# Altium schematic sheet DAC.SchDoc
size Letter; PageSetup: Record=PageOptions|CenterHorizontal=True|CenterVertical=True|PrintScale=0.75|XCorrection=1.00|YCorrection=1.00|PrintKind=1|BorderSize=5000000|LeftOffset=0|BottomOffset=0|Orientation=2|PaperLength=1000|PaperWidth=1000|Scale=100|PaperSource=7|PrintQuality=-4|MediaType=1|DitherType=10|PaperKind=Letter|PrintScaleMode=1; Author: Adam Gilbert; CompanyName: McGill University; DrawnBy: Adam Gilbert; Organization: Altium Limited; Address1: McGill Cosmology; Address2: 3600 University Street; Address3: Montreal, Quebec; Address4: Canada; DocumentNumber: 7; Revision: Rev2; SheetNumber: 7; SheetTotal: 16; ProjectTitle: DfMux FMC Mezz; ModelNumber: MGMEZZ04; ProjectName: DfMux FMC Mezz
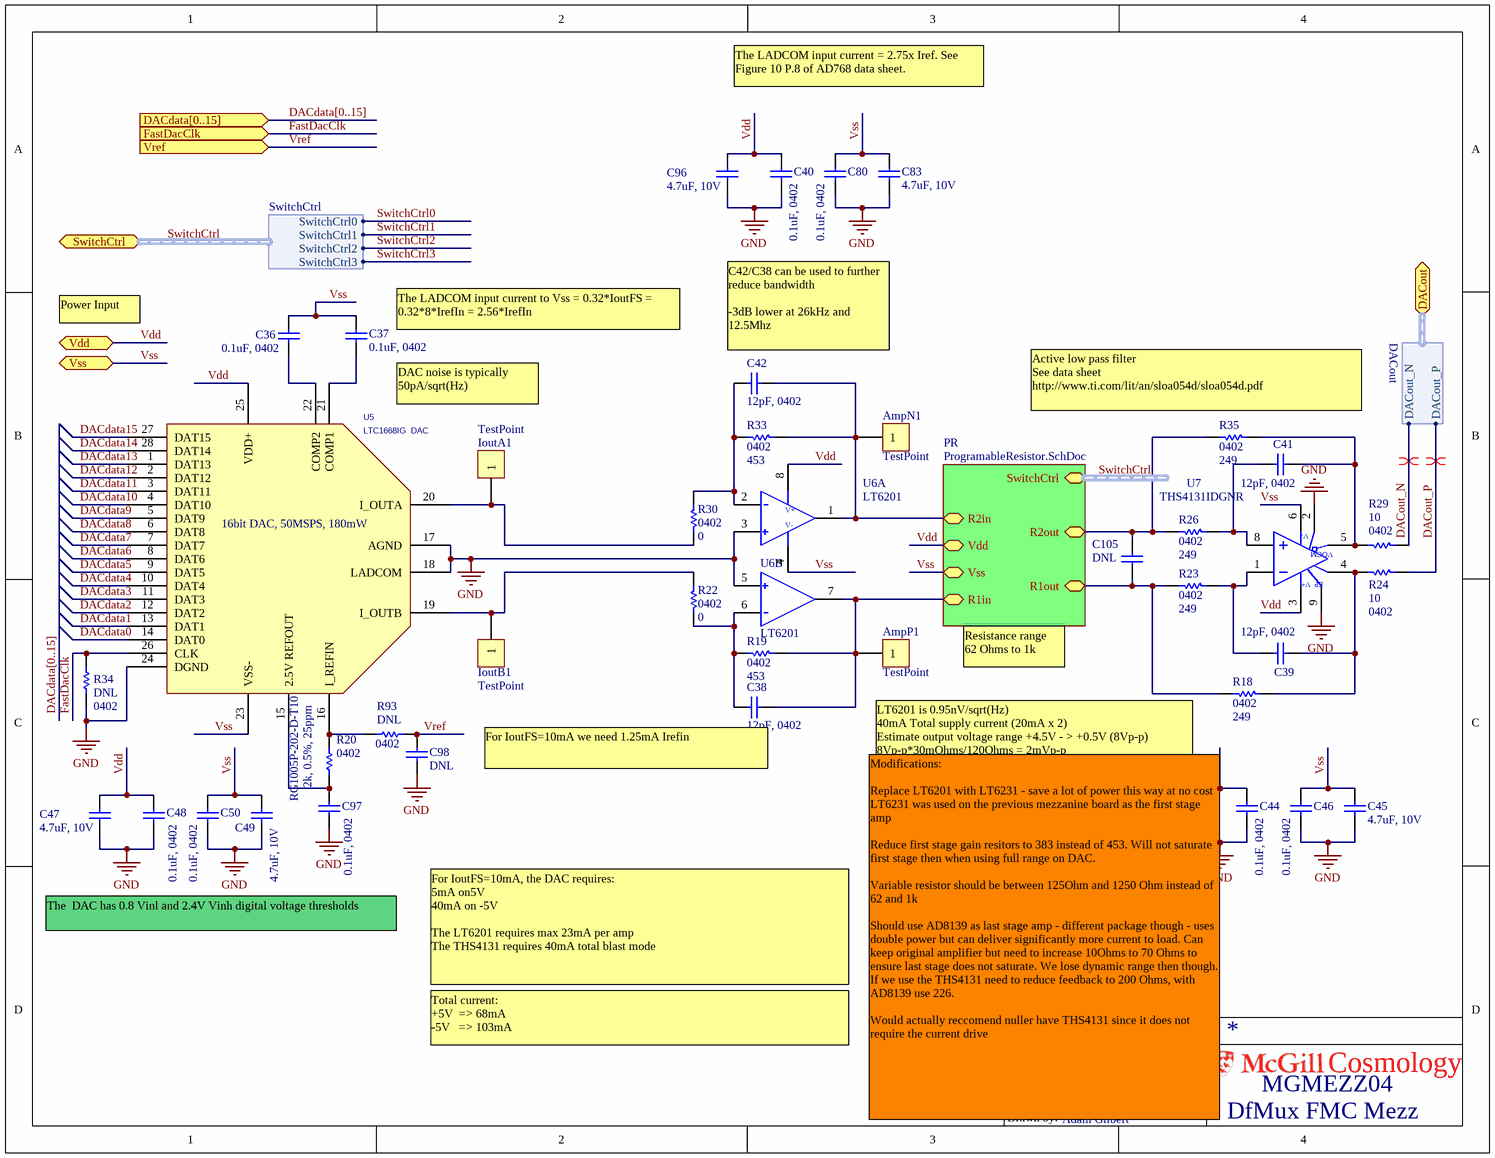
[diagram p0: DAC.SchDoc]

## Parts
AmpN1  TestPoint  [TP-3520-SK]  (no BOM)
AmpP1  TestPoint  [TP-3520-SK]  (no BOM)
C36  0.1uF, 0402  [0402]
C37  0.1uF, 0402  [0402]
C38  12pF, 0402  [0402]
C39  12pF, 0402  [0402]
C40  0.1uF, 0402  [0402]
C41  12pF, 0402  [0402]
C42  12pF, 0402  [0402]
C43  4.7uF, 10V  [0805]
C44  0.1uF, 0402  [0402]
C45  4.7uF, 10V  [0805]
C46  0.1uF, 0402  [0402]
C47  4.7uF, 10V  [0805]
C48  0.1uF, 0402  [0402]
C49  4.7uF, 10V  [0805]
C50  0.1uF, 0402  [0402]
C80  0.1uF, 0402  [0402]
C83  4.7uF, 10V  [0805]
C96  4.7uF, 10V  [0805]
C97  0.1uF, 0402  [0402]
C98  DNL  [0805]
C105  DNL  [0402]
IoutA1  TestPoint  [TP-3520-SK]  (no BOM)
IoutB1  TestPoint  [TP-3520-SK]  (no BOM)
R18  249  [0402]
R19  453  [0402]
R20  Manufacturer Part Number 1: RG1005P-202-D-T10  [0402]  (hidden comment: 2k, 0.5%, 25ppm)
R22  0  [0402]
R23  249  [0402]
R24  10  [0402]
R26  249  [0402]
R29  10  [0402]
R30  0  [0402]
R33  453  [0402]
R34  DNL  [0402]
R35  249  [0402]
R93  DNL  [0402]
U5  LTC1668IG  DAC  [SOG.65M/28/WG8.20/L10.16]
U6  LT6201  [SO8]  (parts A,B of 2)
U7  THS4131IDGNR  [SOP8-EP-127P600-8N]

## Sub-sheets
PR = ProgramableResistor.SchDoc: R1in, R2in, R1out, R2out, Vdd, Vss, SwitchCtrl (harness SwitchCtrl)

## Ports
DACdata[0..15] (in), DACout (harness DACout), FastDacClk (in), SwitchCtrl (harness SwitchCtrl), Vdd, Vref (in), Vss

## Harnesses
DACout: DACout_N, DACout_P
SwitchCtrl: SwitchCtrl0, SwitchCtrl1, SwitchCtrl2, SwitchCtrl3

## Nets
GND: C40.1 C43.1 C44.1 C45.1 C46.1 C47.1 C48.1 C49.1 C50.1 C80.1 C83.1 C96.1 C97.1 C98.1 R34.1 U5.17(AGND) U5.18(LADCOM) U5.24(DGND) U6.3(IN+) U6.5(IN+) U7.2(VOCM) U7.9(EP)
DACdata0: U5.14(DAT0)
DACdata1: U5.13(DAT1)
DACdata2: U5.12(DAT2)
DACdata3: U5.11(DAT3)
DACdata4: U5.10(DAT4)
DACdata5: U5.9(DAT5)
DACdata6: U5.8(DAT6)
DACdata7: U5.7(DAT7)
DACdata8: U5.6(DAT8)
DACdata9: U5.5(DAT9)
DACdata10: U5.4(DAT10)
DACdata11: U5.3(DAT11)
DACdata12: U5.2(DAT12)
DACdata13: U5.1(DAT13)
DACdata14: U5.28(DAT14)
DACdata15: U5.27(DAT15)
DACout_N: R29.2 ; port DACout.DACout_N
DACout_P: R24.2 ; port DACout.DACout_P
FastDacClk: R34.2 U5.26(CLK) ; port FastDacClk
SwitchCtrl0: port SwitchCtrl.SwitchCtrl0  [project net SwitchCtrl.SwitchCtrl0]
SwitchCtrl1: port SwitchCtrl.SwitchCtrl1  [project net SwitchCtrl.SwitchCtrl1]
SwitchCtrl2: port SwitchCtrl.SwitchCtrl2  [project net SwitchCtrl.SwitchCtrl2]
SwitchCtrl3: port SwitchCtrl.SwitchCtrl3  [project net SwitchCtrl.SwitchCtrl3]
Vdd: C40.2 C43.2 C44.2 C47.2 C48.2 C96.2 U5.25(VDD+) U6.8(V+) U7.3(V+) ; port Vdd, sheet PR/Vdd
Vref: C98.2 R93.1 ; port Vref
Vss: C36.2 C37.2 C45.2 C46.2 C49.2 C50.2 C80.2 C83.2 U5.23(VSS-) U6.4(V-) U7.6(V-) ; port Vss, sheet PR/Vss
NetAmpN1_1: AmpN1.1 C42.1 R33.2 U6.1(Out) ; sheet PR/R2in
NetAmpP1_1: AmpP1.1 C38.1 R19.2 U6.7(Out) ; sheet PR/R1in
NetC36_1: C36.1 U5.22(COMP2)
NetC37_1: C37.1 U5.21(COMP1)
NetC38_2: C38.2 R19.1 R22.1 U6.6(IN-)
NetC39_1: C39.1 R18.2 R24.1 U7.4(OUT+)
NetC39_2: C39.2 R23.2 U7.1(IN-)
NetC41_1: C41.1 R29.1 R35.2 U7.5(OUT-)
NetC41_2: C41.2 R26.2 U7.8(IN+)
NetC42_2: C42.2 R30.2 R33.1 U6.2(IN-)
NetC97_2: C97.2 R20.1 U5.15(2.5V_REFOUT)
NetC105_1: C105.1 R26.1 R35.1 ; sheet PR/R2out
NetC105_2: C105.2 R18.1 R23.1 ; sheet PR/R1out
NetIoutA1_1: IoutA1.1 R30.1 U5.20(I_OUTA)
NetIoutB1_1: IoutB1.1 R22.2 U5.19(I_OUTB)
NetR20_2: R20.2 R93.2 U5.16(I_REFIN)

Not connected (* = marked no-connect by the designer): U7 7(NC)

## Buses and harness runs
bus DACdata[0..15]
bus DACdata[0..15] = port DACdata[0..15]
harness SwitchCtrl = port SwitchCtrl
harness SwitchCtrl = sheet PR/SwitchCtrl

## Layout directives
differential pair: DACout_N, DACout_P

## Notes on the sheet
- The LADCOM input current = 2.75x Iref. See Figure 10 P.8 of AD768 data sheet.
- Power Input
- (near C37) The LADCOM input current to Vss = 0.32*IoutFS = 0.32*8*IrefIn = 2.56*IrefIn
- (near C42) C42/C38 can be used to further reduce bandwidth
  -3dB lower at 26kHz and 12.5Mhz
- (near U5) DAC noise is typically 50pA/sqrt(Hz)
- (near R35) Active low pass filter
  See data sheet
  http://www.ti.com/lit/an/sloa054d/sloa054d.pdf
- Resistance range
  62 Ohms to 1k
- (near C38) For IoutFS=10mA we need 1.25mA Irefin
- (near C43) LT6201 is 0.95nV/sqrt(Hz)
  40mA Total supply current (20mA x 2)
  Estimate output voltage range +4.5V - > +0.5V (8Vp-p)
  8Vp-p*30mOhms/120Ohms = 2mVp-p
  The LT6231 is pin compatible - uses way less current than LT6201 and seems to perform better in every way except for swing
  The ADA4898-2 is also compatible
- The  DAC has 0.8 Vinl and 2.4V Vinh digital voltage thresholds
- For IoutFS=10mA, the DAC requires:
  5mA on5V
  40mA on -5V
  The LT6201 requires max 23mA per amp
  The THS4131 requires 40mA total blast mode
- Total current:
  +5V  => 68mA
  -5V   => 103mA
- (near C43) Modifications:
  Replace LT6201 with LT6231 - save a lot of power this way at no cost
  LT6231 was used on the previous mezzanine board as the first stage amp
  Reduce first stage gain resitors to 383 instead of 453. Will not saturate first stage then when using full range on DAC.
  Variable resistor should be between 125Ohm and 1250 Ohm instead of 62 and 1k
  Should use AD8139 as last stage amp - different package though - uses double power but can deliver significantly more current to load. Can keep original amplifier but need to increase 10Ohms to 70 Ohms to ensure last stage does not saturate. We lose dynamic range then though. If we use the THS4131 need to reduce feedback to 200 Ohms, with AD8139 use 226.
  Would actually reccomend nuller have THS4131 since it does not require the current drive
- File:
- Size:
- Date:
- Letter
- Revision:
- Sheet
- of
- Cosmology
- Drawn by:
- (in symbol LTC1668IG  DAC) 16bit DAC, 50MSPS, 180mW

## Library data of the parts
AmpN1 AmpP1 IoutA1 IoutB1 = TestPoint: TestPoint1; Assembly Comments: none; Footprint: *
C36 C37 C40 C44 C46 C48 C50 C80 C97 = CAP 0603: Capacitor, Ceramic, 0402; Part Constraints: 10% 10V X5R 0402; Manufacturer: TDK Corporation; Manufacturer Part Number 1: C1005X5R1A104K050BA; Temperature Coefficient: X5R; Assembly Comments: none; Value: 0.1uF, 0402; Supplier 1: Digi-Key; Supplier Part Number 1: 445-1265-1-ND; Operating Temperature: -55°C ~ 85°C; Thickness (Max): 0.022" (0.55mm); Packaging: Cut Tape (CT)
C38 C39 C41 C42 C105 = CAP 0402: Capacitor, Ceramic, 0402; Part Constraints: 10% 16V X7R 0402; Manufacturer: Generic; Assembly Comments: none; Manufacturer Part Number 1: Generic
  C38 C39 C41 C42: Value: 12pF, 0402
  C105: Value: DNL
C43 C45 C47 C49 C83 C96 C98 = CAP 0805: Capacitor, Ceramic, 0805; Manufacturer Part Number 1: LMK212BJ475KD-T; Manufacturer: Taiyo Yuden; Temperature Coefficient: X5R; Assembly Comments: none; Supplier 1: Digi-Key; Supplier Part Number 1: 587-1297-6-ND; Packaging: Digi-Reel®; Operating Temperature: -55°C ~ 85°C; Thickness (Max): 0.037" (0.95mm); Part Constraints: LMK212BJ475KD-T
  C43 C45 C47 C49 C83 C96: Value: 4.7uF, 10V
  C98: Value: DNL
R18 R19 R22-R24 R26 R29 R30 R33-R35 = RES 0402: Resistor; Manufacturer: Generic; Part Constraints: 1% 1/10W 100ppm 0402; Assembly Comments: none; Manufacturer Part Number 1: Generic
  R18 R23 R26 R35: Value: 249
  R19 R33: Value: 453
  R22 R30: Value: 0
  R24 R29: Value: 10
  R34: Value: DNL
R20 = RES 0402: Resistor; Manufacturer: Susumu; Part Constraints: 2k, 0.5%, 25ppm. 0402; Assembly Comments: none; Temperature Coefficient: ±25ppm/°C; Value: 2k, 0.5%, 25ppm; Supplier 1: Digi-Key; Supplier Part Number 1: RG10P2.00KDCT-ND; Packaging: Cut Tape (CT)
R93 = RES 0402: Resistor; Manufacturer: Susumu; Part Constraints: 2k, 0.5%, 25ppm. 0402; Manufacturer Part Number 1: RG1005P-202-D-T10; Assembly Comments: none; Temperature Coefficient: ±25ppm/°C; Value: DNL; Supplier 1: Digi-Key; Supplier Part Number 1: RG10P2.00KDCT-ND; Packaging: Cut Tape (CT)
U5 = LTC1668IG  DAC: IC DAC 16BIT 50MSPS 28SSOP; Manufacturer: Linear Technology; Assembly Comments: none; Supplier 1: Digi-Key; Manufacturer Part Number 1: LTC1668IG; Operating Temperature: -40°C ~ 85°C; Packaging: Tube; Supplier Part Number 1: LTC1668IG-ND; Part Constraints: LTC1668IG
U6 = LT6201: Dual R-R Opamp Soic 8 165Mhz GBP; Part Constraints: LT6201CS8#PBF; Manufacturer: Linear Technology; Assembly Comments: none; Supplier 1: Digi-Key; Supplier Part Number 1: LT6201CS8#PBF-ND; Manufacturer Part Number 1: LT6201CS8#PBF
U7 = THS4131IDGNR: IC OPAMP DIFF 225MHZ SGL 8MSOP; Manufacturer: Texas Instruments; Assembly Comments: none; Supplier 1: Digi-Key; Manufacturer Part Number 1: THS4131IDGNR; Operating Temperature: -40°C ~ 85°C; Packaging: Cut Tape (CT); Supplier Part Number 1: 296-10047-1-ND; Part Constraints: THS4131IDGNR